# Altium schematic sheet Breakout.SchDoc
size A4; DocumentNumber: 1; SheetNumber: 1
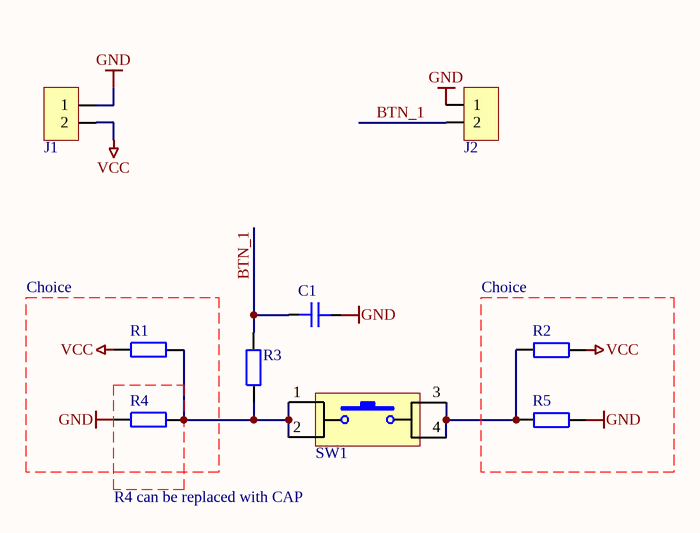
[diagram p0: Breakout.SchDoc]

## Parts
C1  ? F  [0805C_RF_M]  (value not drawn)
J1  PINHDR-2P1  [HEADER-2.54-2P1]  (value not drawn)
J2  PINHDR-2P1  [HEADER-2.54-2P1]  (value not drawn)
R1  ? R  [0805R_RF_M]  (value not drawn)
R2  ? R  [0805R_RF_M]  (value not drawn)
R3  ? R  [0805R_RF_M]  (value not drawn)
R4  ? R  [0805R_RF_M]  (value not drawn)
R5  ? R  [0805R_RF_M]  (value not drawn)
SW1  BTN-SPST-NO-4C  [TE_CONN_1825910-6-4]  (value not drawn)

## Nets
GND: C1.1 J1.1 J2.1 R4.2 R5.2
VCC: J1.2 R1.2 R2.2
BTN_1: C1.2 J2.2 R3.2
NetR1_1: R1.1 R3.1 R4.1 SW1.1 SW1.2
NetR2_1: R2.1 R5.1 SW1.3 SW1.4

## Notes on the sheet
- Choice
- (near R2) Choice
- R4 can be replaced with CAP
- Author
- Date
- Revision
- Size
- A4
- Sheet
- of

## Library data of the parts
C1 = C: Capacitor; Manufacturer: Generic Brand; Max Voltage: ? V; Value: ? F; Tolerance: ?; Mounting Technology: SMT; Tag: *; Manufacturer Part No: *; Supplier: *; Supplier Link: http://; Supplier Part No: *; Category: Capacitor
J1 J2 = PINHDR-2P1: Pin Header Single Row 2 Positions; Mounting Technology: THT
R1-R5 = R: Resistor; Manufacturer: Generic Brand; Power Rating: ? W; Max Voltage: ? V; Value: ? R; Tolerance: ?; Supplier Link: http://; Category: Resistor; Mounting Technology: SMT
SW1 = BTN-SPST-NO-4C: Tactile Switch SPST-NO; Manufacturer: Generic Brand; Category: Tactile Button; Mounting Technology: THT; Supplier Link: http://